# Altium schematic sheet FTDI.SchDoc: Наименование
size 420 x 297 mm; ApprovedBy: Утвердил; CheckedBy: Проверил; Author: Михайловский; CompanyName: Организация; DrawnBy: Н.Контр; Engineer: Т.Контр; SheetNumber: 1; SheetTotal: 1; PageSetup: Record=PageOptions|CenterHorizontal=True|CenterVertical=True|PrintScale=0.94|XCorrection=1.00|YCorrection=1.00|PrintKind=1|BorderSize=5000000|LeftOffset=0|BottomOffset=0|Orientation=1|PaperLength=1000|PaperWidth=1000|Scale=100|PaperSource=7|PrintQuality=-4|MediaType=1|DitherType=10|PaperKind=A4|PrintScaleMode=1; DecimalNumber: FTDI; HeadOfSector: Нач. сектора; MainDevice: Перв.примен.; Name: Наименование; DocumentName: Sheet1.SCHDOC
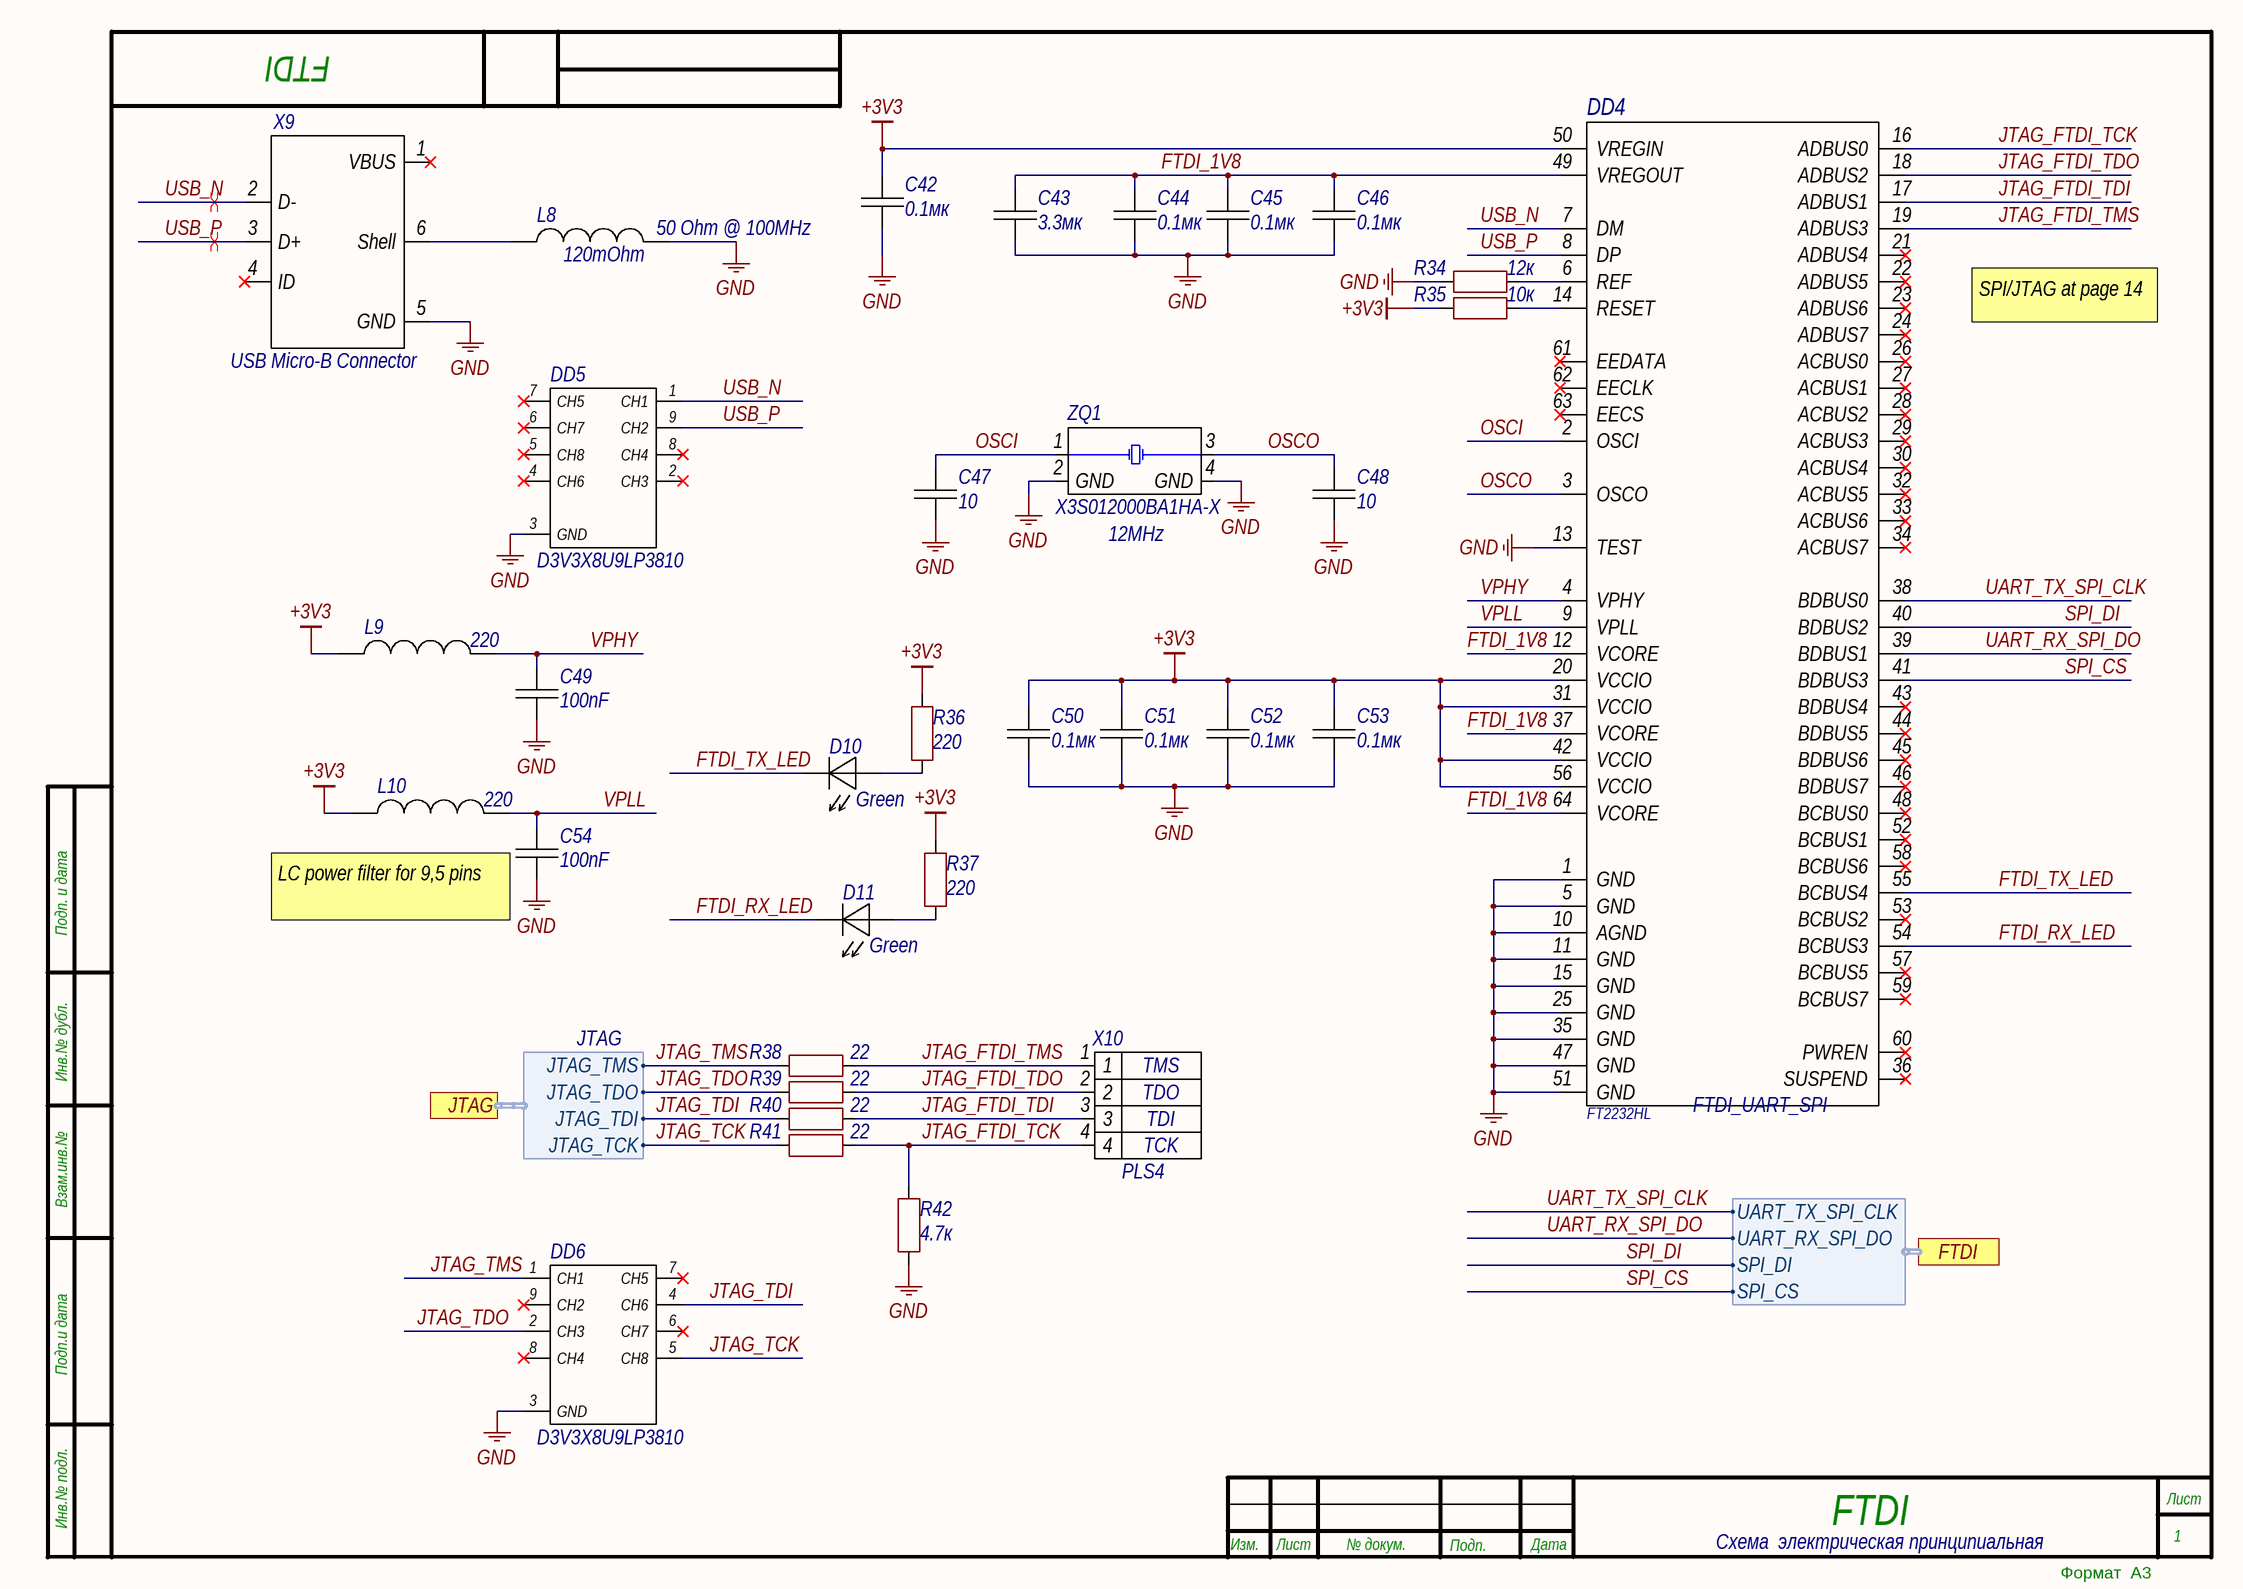
[diagram p0: FTDI.SchDoc]

## Parts
C42  value 0.1мк  [CAP0402]  (hidden comment: 0.1мк 50V)
C43  value 3.3мк  [CAP0402]  (hidden comment: 3.3мк 6.3V)
C44  value 0.1мк  [CAP0402]  (hidden comment: 0.1мк 50V)
C45  value 0.1мк  [CAP0402]  (hidden comment: 0.1мк 50V)
C46  value 0.1мк  [CAP0402]  (hidden comment: 0.1мк 50V)
C47  value 10  [CAP0402]  (hidden comment: 10 50V)
C48  value 10  [CAP0402]  (hidden comment: 10 50V)
C49  value 100nF  [CAP0402]  (hidden comment: 100nF 50V)
C50  value 0.1мк  [CAP0402]  (hidden comment: 0.1мк 50V)
C51  value 0.1мк  [CAP0402]  (hidden comment: 0.1мк 50V)
C52  value 0.1мк  [CAP0402]  (hidden comment: 0.1мк 50V)
C53  value 0.1мк  [CAP0402]  (hidden comment: 0.1мк 50V)
C54  value 100nF  [CAP0402]  (hidden comment: 100nF 50V)
D10  Green  [LED603]
D11  Green  [LED603]
DD4  MPN: FT2232HL  [LQFP64]
DD5  MPN: D3V3X8U9LP3810  [U-DFN3810-9]  (hidden comment: TVS at USB diff pair)
DD6  MPN: D3V3X8U9LP3810  [U-DFN3810-9]  (hidden comment: TVS Diode at JTAG)
L8  DCResistance: 120mOhm  [CAPC0603N]  (hidden comment: 50 Ohm @ 100MHz)
L9  220  [CAPC0603N]
L10  220  [CAPC0603N]
R34  12к  [RESC0402(1005)_M]
R35  10к  [RESC0402(1005)_M]
R36  220  [RESC0402(1005)_M]
R37  220  [RESC0402(1005)_M]
R38  value 22  [RESC0402(1005)_M]  (hidden comment: 22 1/16W)
R39  value 22  [RESC0402(1005)_M]  (hidden comment: 22 1/16W)
R40  value 22  [RESC0402(1005)_M]  (hidden comment: 22 1/16W)
R41  value 22  [RESC0402(1005)_M]  (hidden comment: 22 1/16W)
R42  value 4.7к  [RESC0402(1005)_M]  (hidden comment: 4.7к 1/16W)
X9  USB Micro-B Connector  [AMPHENOL_10118194-0001LF]
X10  Wire1: TMS  Wire2: TDO  Wire3: TDI  Wire4: TCK  [PLS4]  (hidden comment: PLS4)
ZQ1  MPN: X3S012000BA1HA-X  [TSX-3225_V]  (hidden comment: 12MHz)

## Ports
FTDI (harness FTDI_UART_SPI), JTAG (harness JTAG)

## Harnesses
JTAG: JTAG_TCK, JTAG_TDI, JTAG_TDO, JTAG_TMS
FTDI_UART_SPI: UART_TX_SPI_CLK, UART_RX_SPI_DO, SPI_DI, SPI_CS

## Nets
+3V3: C42.1 C50.2 C51.2 C52.2 C53.2 DD4.20(VCCIO) DD4.31(VCCIO) DD4.42(VCCIO) DD4.50(VREGIN) DD4.56(VCCIO) L9.1 L10.1 R35.2 R36.2 R37.2
GND: C42.2 C43.1 C44.2 C45.2 C46.2 C47.1 C48.1 C49.1 C50.1 C51.1 C52.1 C53.1 C54.1 DD4.1(GND) DD4.5(GND) DD4.10(AGND) DD4.11(GND) DD4.13(TEST) DD4.15(GND) DD4.25(GND) DD4.35(GND) DD4.47(GND) DD4.51(GND) DD5.3(GND) DD6.3(GND) L8.2 R34.2 R42.2 X9.5(GND) ZQ1.2(GND) ZQ1.4(GND)
FTDI_1V8: C43.2 C44.1 C45.1 C46.1 DD4.12(VCORE) DD4.37(VCORE) DD4.49(VREGOUT) DD4.64(VCORE)
FTDI_RX_LED: D11.1(A) DD4.54(BCBUS3)
FTDI_TX_LED: D10.1(A) DD4.55(BCBUS4)
JTAG_FTDI_TCK: DD4.16(ADBUS0) R41.2 R42.1 X10.4
JTAG_FTDI_TDI: DD4.17(ADBUS1) R40.2 X10.3
JTAG_FTDI_TDO: DD4.18(ADBUS2) R39.2 X10.2
JTAG_FTDI_TMS: DD4.19(ADBUS3) R38.2 X10.1
JTAG_TCK: DD6.5(CH8) R41.1 ; port JTAG.JTAG_TCK
JTAG_TDI: DD6.4(CH6) R40.1 ; port JTAG.JTAG_TDI
JTAG_TDO: DD6.2(CH3) R39.1 ; port JTAG.JTAG_TDO
JTAG_TMS: DD6.1(CH1) R38.1 ; port JTAG.JTAG_TMS
OSCI: C47.2 DD4.2(OSCI) ZQ1.1(X1)
OSCO: C48.2 DD4.3(OSCO) ZQ1.3(X2)
SPI_CS: DD4.41(BDBUS3) ; port FTDI.SPI_CS
SPI_DI: DD4.40(BDBUS2) ; port FTDI.SPI_DI
UART_RX_SPI_DO: DD4.39(BDBUS1) ; port FTDI.UART_RX_SPI_DO
UART_TX_SPI_CLK: DD4.38(BDBUS0) ; port FTDI.UART_TX_SPI_CLK
USB_N: DD4.7(DM) DD5.1(CH1) X9.2(D-)
USB_P: DD4.8(DP) DD5.9(CH2) X9.3(D+)
VPHY: C49.2 DD4.4(VPHY) L9.2
VPLL: C54.2 DD4.9(VPLL) L10.2
NetD10_2: D10.2(K) R36.1
NetD11_2: D11.2(K) R37.1
NetDD4_6: DD4.6(REF) R34.1
NetDD4_14: DD4.14(RESET) R35.1
NetL8_1: L8.1 X9.6(Shell)

Not connected (* = marked no-connect by the designer): DD4 21(ADBUS4)* 22(ADBUS5)* 23(ADBUS6)* 24(ADBUS7)* 26(ACBUS0)* 27(ACBUS1)* 28(ACBUS2)* 29(ACBUS3)* 30(ACBUS4)* 32(ACBUS5)* 33(ACBUS6)* 34(ACBUS7)* 36(SUSPEND)* 43(BDBUS4)* 44(BDBUS5)* 45(BDBUS6)* 46(BDBUS7)* 48(BCBUS0)* 52(BCBUS1)* 53(BCBUS2)* 57(BCBUS5)* 58(BCBUS6)* 59(BCBUS7)* 60(PWREN)* 61(EEDATA)* 62(EECLK)* 63(EECS)*; DD5 2(CH3)* 4(CH6)* 5(CH8)* 6(CH7)* 7(CH5)* 8(CH4)*; DD6 6(CH7)* 7(CH5)* 8(CH4)* 9(CH2)*; X9 1(VBUS)* 4(ID)*

## Layout directives
differential pair; differential pair class USB: USB_N, USB_P

## Notes on the sheet
- SPI/JTAG at page 14
- LC power filter for 9,5 pins
- Схема  электрическая принципиальная
- Подп. и дата
- Инв.№ дубл.
- Взам.инв.№
- Подп.и дата
- Инв.№ подл.
- Изм.
- Лист
- № докум.
- Подп.
- Дата
- Формат  A3

## Library data of the parts
C42 C44-C46 C49-C54 = CAP0402: Manufacturer: Samsung Electro-Mechanics; ManufacturerAlt: JLCPCB; MPN: CL05B104KB54PNC; MPNAlt: C307331; MntType: SMD; Notes: Basic Part; Tolerance: 10%; Height: 0.5mm; MSL: MSL 1; Package: =Footprint; RoHS: Comply; Weight: 1.500mg; PartType: CHIP CERAMIC CAPACITOR; Pins: 2; BOMDescription: =MntType+' '+PartType+' '+Package+' '+Value+' '+Tolerance+' '+Voltage+' '+TempCoeff+' '+MPN; CFootprint: =Footprint; Voltage: 50V; Part Number: CAP0402; ClassName: Capacitor; ComponentLink1Description: Datasheet; ComponentLink1Description: New link; ComponentLink1URL: https://datasheet.lcsc.com/lcsc/1810191222_Samsung-Electro-Mechanics-CL05B104KB54PNC_C307331.pdf
C43 = CAP0402: Manufacturer: TDK; ManufacturerAlt: JLCPCB; MPN: C1005X5R0J335MTJ00E; MPNAlt: C694161; MntType: SMD; MSL: MSL 1; Package: =Footprint; RoHS: Comply; PartType: CHIP CERAMIC CAPACITOR; Pins: 2; BOMDescription: =MntType+' '+PartType+' '+Package+' '+Value+' '+Tolerance+' '+Voltage+' '+TempCoeff+' '+MPN; CFootprint: =Footprint; Voltage: 6.3V; Part Number: CAP0402; ClassName: Capacitor; ComponentLink1Description: Datasheet
C47 C48 = CAP0402: Manufacturer: Samsung Electro-Mechanics; ManufacturerAlt: JLCPCB; MPN: CL05C100JB5NNNC; MPNAlt: C32949; MntType: SMD; MSL: MSL 1; Package: =Footprint; RoHS: Comply; PartType: CHIP CERAMIC CAPACITOR; Pins: 2; BOMDescription: =MntType+' '+PartType+' '+Package+' '+Value+' '+Tolerance+' '+Voltage+' '+TempCoeff+' '+MPN; CFootprint: =Footprint; Voltage: 50V; Part Number: CAP0402; ClassName: Capacitor; ComponentLink1Description: Datasheet
D10 D11 = LEDC: Manufacturer: Everlight Elec; ManufacturerAlt: JLCPCB; MPN: 19-217/GHC-YR1S2/3T; MPNAlt: C72043; MntType: SMD; MSL: MSL 5; Package: =Footprint; RoHS: Comply; PartType: CHIP LED; Pins: 2; BOMDescription: =MntType+' '+PartType+' '+Package+' '+Value+' '+Tolerance+' '+Voltage+' '+TempCoeff+' '+MPN; CFootprint: =Footprint; Value: Green; Part Number: LEDC; ClassName: LED; ComponentLink1Description: Datasheet
DD4 = FT2232HL: Manufacturer: FTDI; MntType: SMD; Part Number: FT2232HL; MSL: MSL 1; Package: LQFP64; RoHS: Comply; PartType: FTDI; Pins: 64; BOMDescription: FT2232HL; CFootprint: =Footprint; ClassName: FTDI; ComponentLink1Description: Datasheet; ComponentLink1URL: https://ftdichip.com/wp-content/uploads/2020/07/DS_FT2232H.pdf
DD5 = D3V3X8U9LP3810: Manufacturer: DiodesInc; ManufacturerAlt: JLCPCB; MPNAlt: C1973794; MntType: SMD; Part Number: D3V3X8U9LP3810; MSL: MSL 1; Package: =Footprint; RoHS: Comply; PartType: TVS; Pins: 9; BOMDescription: D3V3X8U9LP3810; CFootprint: =Footprint; ClassName: TVS; ComponentLink1Description: Datasheet; ComponentLink1URL: https://www.elitan.ru/pdf/1/1/5/3/0/11530248.pdf
DD6 = D3V3X8U9LP3810: Manufacturer: DiodesInc; MntType: SMD; Part Number: D3V3X8U9LP3810; MSL: MSL 1; Package: =Footprint; RoHS: Comply; PartType: TVS; Pins: 9; BOMDescription: D3V3X8U9LP3810; CFootprint: =Footprint; ClassName: TVS; ComponentLink1Description: Datasheet; ComponentLink1URL: https://www.diodes.com/assets/Datasheets/D3V3X8U9LP3810.pdf
L8 = Inductor_SMD: Manufacturer: FH(Guangdong Fenghua Advanced Tech); ManufacturerAlt: JLCPCB; MPN: CBW160808U500T; MPNAlt: C394476; MntType: SMD; MSL: MSL 1; Package: =Footprint; RoHS: Comply; PartType: INDUCTOR; Pins: 2; BOMDescription: =MntType+' '+PartType+' '+Package+' '+Value+' '+Tolerance+' '+Voltage+' '+TempCoeff+' '+MPN; CFootprint: =Footprint; Value: 50 Ohm @ 100MHz; Part Number: Inductor_SMD; ClassName: Inductor; ComponentLink1Description: Datasheet; ComponentLink1Description: New link; ComponentLink1URL: https://datasheet.lcsc.com/lcsc/1912111437_FH-Guangdong-Fenghua-Advanced-Tech-CBW160808U500T_C394476.pdf
L9 L10 = BLM18KG221SN1D: Manufacturer: Murata; ManufacturerAlt: JLCPCB; MPNAlt: C88980; MntType: SMD; Tolerance: 25%; MPN: BLM18KG221SN1D; Height: 0.6mm; MSL: MSL 1; Package: =Footprint; RoHS: Comply; Weight: 35mg; PartType: Ferrite Beads; Pins: 2; BOMDescription: =MntType+' '+PartType+' '+Package+' '+Value+' '+Tolerance+' '+Voltage+' '+TempCoeff+' '+MPN; CFootprint: =Footprint; Value: 220; Part Number: BLM18KG221SN1D; ClassName: Ferrite Beads; ComponentLink1Description: Datasheet; ComponentLink1URL: https://ru.mouser.com/datasheet/2/281/ENFA0003-1915778.pdf
R34 = RES0402: Manufacturer: UNI-ROYAL(Uniroyal Elec); ManufacturerAlt: JLCPCB; MPN: 0402WGF1202TCE; MPNAlt: C25752; MntType: SMD; MSL: MSL 1; Package: =Footprint; RoHS: Comply; PartType: CHIP RESISTOR; Pins: 2; BOMDescription: =MntType+' '+PartType+' '+Package+' '+Value+' '+Tolerance+' '+Voltage+' '+TempCoeff+' '+MPN; CFootprint: =Footprint; Value: 12к; Part Number: RES0402; ClassName: Resistor; ComponentLink1Description: Datasheet
R35 = RES0402: Manufacturer: UNI-ROYAL(Uniroyal Elec); ManufacturerAlt: JLCPCB; MPN: 0402WGF1002TCE; MPNAlt: C25744; MntType: SMD; MSL: MSL 1; Package: =Footprint; RoHS: Comply; PartType: CHIP RESISTOR; Pins: 2; BOMDescription: =MntType+' '+PartType+' '+Package+' '+Value+' '+Tolerance+' '+Voltage+' '+TempCoeff+' '+MPN; CFootprint: =Footprint; Value: 10к; Part Number: RES0402; ClassName: Resistor; ComponentLink1Description: Datasheet
R36 R37 = RES0402: Manufacturer: UNI-ROYAL(Uniroyal Elec); ManufacturerAlt: JLCPCB; MPN: 0402WGF2200TCE; MPNAlt: C25091; MntType: SMD; MSL: MSL 1; Package: =Footprint; RoHS: Comply; PartType: CHIP RESISTOR; Pins: 2; BOMDescription: =MntType+' '+PartType+' '+Package+' '+Value+' '+Tolerance+' '+Voltage+' '+TempCoeff+' '+MPN; CFootprint: =Footprint; Value: 220; Part Number: RES0402; ClassName: Resistor; ComponentLink1Description: Datasheet
R38-R41 = RES0402: Manufacturer: UNI-ROYAL; ManufacturerAlt: JLCPCB; MPN: 0402WGF220JTCE; MPNAlt: C25092; MntType: SMD; Notes: Basic Part; TempCoeff: 200ppm/C; Tolerance: 1%; Voltage: 50V; Height: 0.35mm; MSL: MSL 1; Package: =Footprint; Power: 1/16W; RoHS: Comply; PartType: CHIP RESISTOR; Pins: 2; BOMDescription: =MntType+' '+PartType+' '+Package+' '+Value+' '+Tolerance+' '+Voltage+' '+TempCoeff+' '+MPN; CFootprint: =Footprint; Part Number: RES0402; ClassName: Resistor; ComponentLink1Description: Datasheet; ComponentLink1Description: New link; ComponentLink1URL: https://datasheet.lcsc.com/lcsc/1811011231_UNI-ROYAL-Uniroyal-Elec-0402WGF220JTCE_C25092.pdf
R42 = RES0402: Manufacturer: UNI-ROYAL; ManufacturerAlt: JLCPCB; MPN: 0402WGF4701TCE; MPNAlt: C25900; MntType: SMD; Notes: Basic Part; TempCoeff: 100ppm/C; Tolerance: 1%; Voltage: 50V; Height: 0.35mm; MSL: MSL 1; Package: =Footprint; Power: 1/16W; RoHS: Comply; PartType: CHIP RESISTOR; Pins: 2; BOMDescription: =MntType+' '+PartType+' '+Package+' '+Value+' '+Tolerance+' '+Voltage+' '+TempCoeff+' '+MPN; CFootprint: =Footprint; Part Number: RES0402; ClassName: Resistor; ComponentLink1Description: Datasheet; ComponentLink1Description: New link; ComponentLink1URL: https://datasheet.lcsc.com/lcsc/1810301132_UNI-ROYAL-Uniroyal-Elec-0402WGF4701TCE_C25900.pdf
X9 = 10118194-0001LF: USB 2.0 Micro-B Female Connector; Manufacturer: Amphenol; ManufacturerAlt: JLCPCB; MPNAlt: C132563; MntType: SMD/TH; Value: USB Micro-B Connector; Part Number: 10118194-0001LF; MPN: 10118194-0001LF; MSL: MSL 1; Package: =Footprint; RoHS: Comply; PartType: CONNECTOR; Pins: 6; BOMDescription: =MntType+' '+PartType+' '+Package+' '+Value+' '+Tolerance+' '+Voltage+' '+TempCoeff+' '+MPN; CFootprint: =Footprint; ClassName: Connector; System: Connector; ComponentLink1Description: Datasheet; ComponentLink1URL: https://cdn.amphenol-icc.com/media/wysiwyg/files/drawing/10118194.pdf
X10 = PLS4: JTAG Header; MntType: DIP; BOMDescription: DIP CONNECTOR CONNPLS4     PLS4; System: Connector; MPN: PLS4; MSL: MSL 1; Package: CONNPLS4; RoHS: Comply; PartType: CONNECTOR; Pins: 4; CFootprint: =Footprint; Part Number: PLS4; ClassName: Connector; ComponentLink1Description: Datasheet
ZQ1 = X3S012000BA1HA-X: Manufacturer: HELE(HARMONY ELEC); MntType: SMD; Part Number: X3S012000BA1HA-X; Value: 12MHz; MSL: MSL 1; Package: SMD3225; RoHS: Comply; PartType: CRYSTAL; Pins: 4; BOMDescription: X3S012000BA1HA-X; CFootprint: =Footprint; ClassName: CRYSTAL; ComponentLink1Description: Datasheet; ComponentLink1URL: https://datasheet.lcsc.com/lcsc/1811121833_HELE-Harmony-Elec-X3S012000BA1HA-X_C254364.pdf